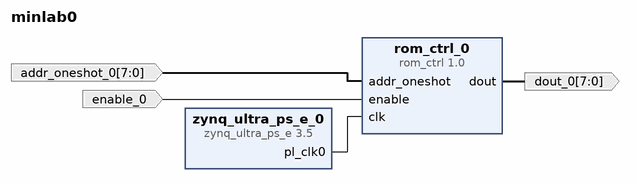
[diagram p0: block diagram of the top level]
# Vivado block design minlab0, xczu3eg-sfvc784-2-e, Vivado 2025.2
create_bd_design minlab0

create_bd_port -dir I -from 7 -to 0 addr_oneshot_0
create_bd_port -dir I enable_0
create_bd_port -dir O -from 7 -to 0 dout_0

create_bd_cell -type ip -vlnv xilinx.com:ip:zynq_ultra_ps_e:3.5 zynq_ultra_ps_e_0
set_property -dict {CONFIG.PSU__DDR_HIGH_ADDRESS_GUI_ENABLE 0 CONFIG.PSU__USE__M_AXI_GP2 0} [get_bd_cells zynq_ultra_ps_e_0]
# 2 more settings of zynq_ultra_ps_e_0 are not shown: defaults, MIO pin electricals, DDR timing, and values the tool derives
create_bd_cell -type ip -vlnv xilinx.com:user:rom_ctrl:1.0 rom_ctrl_0

# ---- connections ----

connect_bd_net -net addr_oneshot_0_1 [get_bd_ports addr_oneshot_0] [get_bd_pins rom_ctrl_0/addr_oneshot]
connect_bd_net -net enable_0_1 [get_bd_ports enable_0] [get_bd_pins rom_ctrl_0/enable]
connect_bd_net [get_bd_pins rom_ctrl_0/dout] [get_bd_ports dout_0]
connect_bd_net [get_bd_pins zynq_ultra_ps_e_0/pl_clk0] [get_bd_pins rom_ctrl_0/clk]

validate_bd_design
save_bd_design
